# EasyEDA schematic Photodiode plate.json
TITLE: Sheet_1; REV: 1.0; Date: 2024-04-13; Sheet: 1/1; Company: Your Company
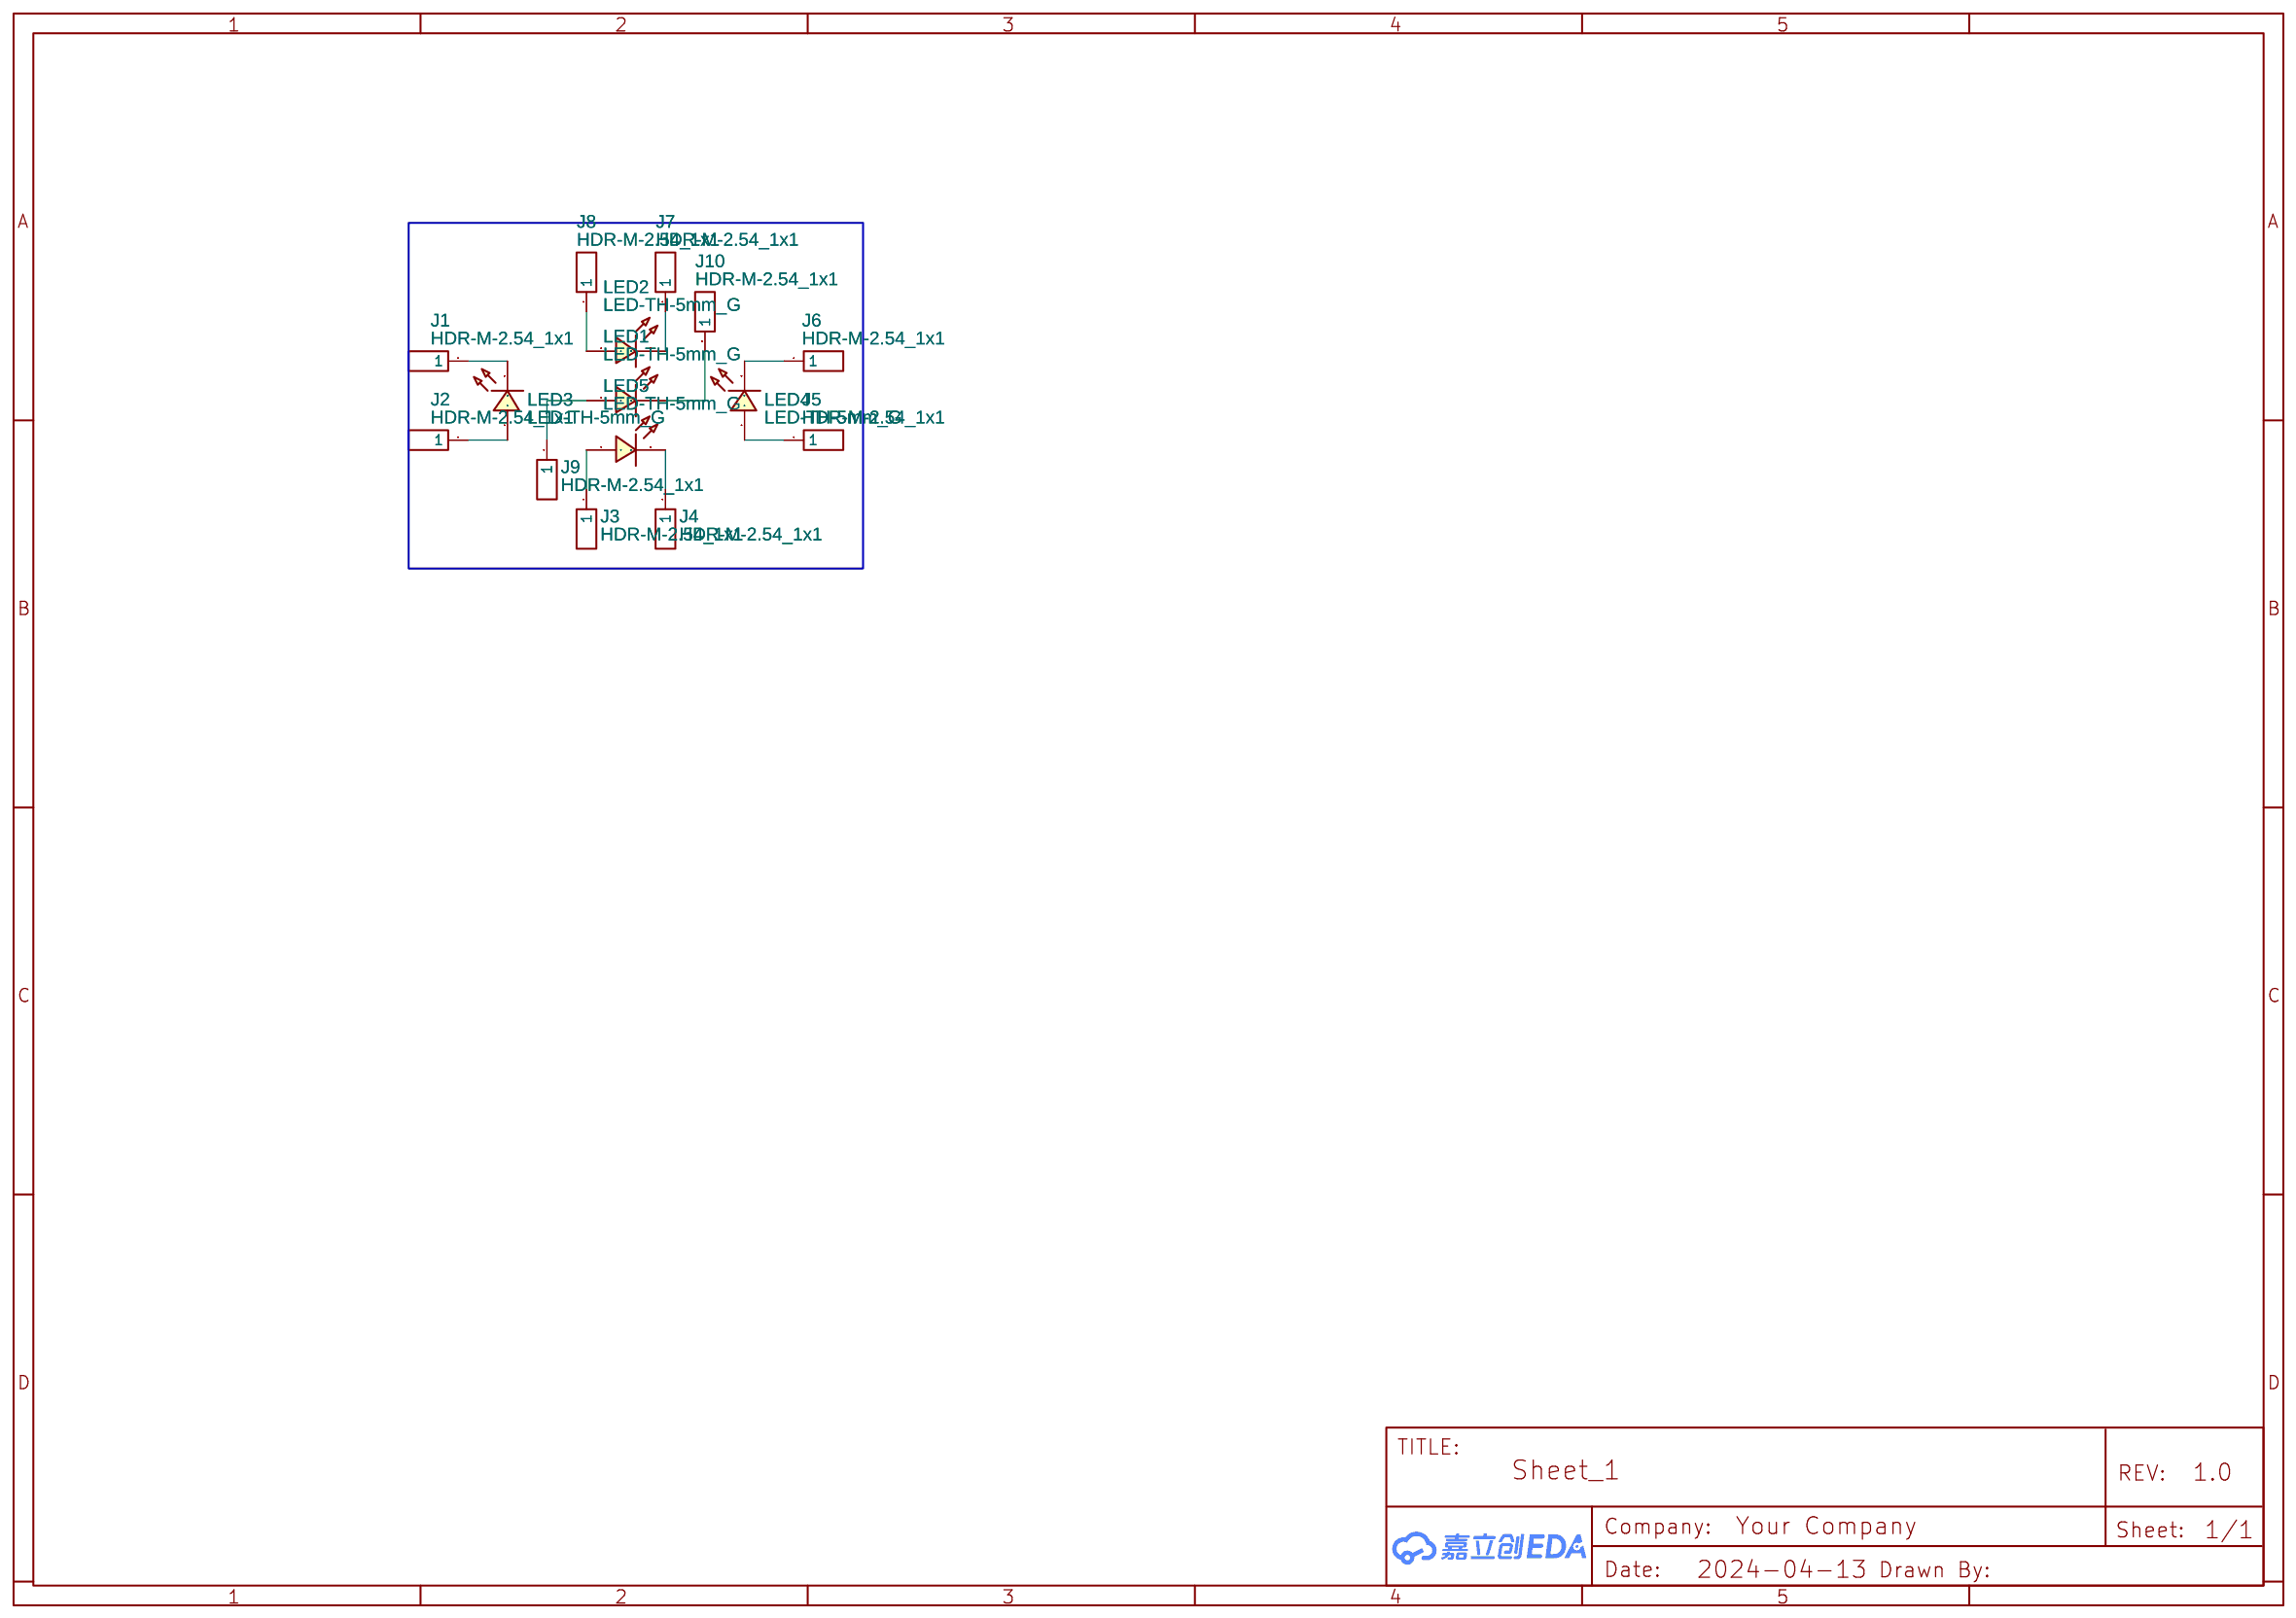
[diagram p0: schematic sheet]

## Parts
J1  HDR-M-2.54_1x1  [HDR-M-2.54_1X1]
J2  HDR-M-2.54_1x1  [HDR-M-2.54_1X1]
J3  HDR-M-2.54_1x1  [HDR-M-2.54_1X1]
J4  HDR-M-2.54_1x1  [HDR-M-2.54_1X1]
J5  HDR-M-2.54_1x1  [HDR-M-2.54_1X1]
J6  HDR-M-2.54_1x1  [HDR-M-2.54_1X1]
J7  HDR-M-2.54_1x1  [HDR-M-2.54_1X1]
J8  HDR-M-2.54_1x1  [HDR-M-2.54_1X1]
J9  HDR-M-2.54_1x1  [HDR-M-2.54_1X1]
J10  HDR-M-2.54_1x1  [HDR-M-2.54_1X1]
LED1  LED-TH-5mm_G  [LED-TH_BD5.0_GREEN]
LED2  LED-TH-5mm_G  [LED-TH_BD5.0_GREEN]
LED3  LED-TH-5mm_G  [LED-TH_BD5.0_GREEN]
LED4  LED-TH-5mm_G  [LED-TH_BD5.0_GREEN]
LED5  LED-TH-5mm_G  [LED-TH_BD5.0_GREEN]

## Library data of the parts
J1-J10 = HDR-M-2.54_1x1: Supplier Part: C81276; Supplier: LCSC; Contributor: LCEDA_Lib
LED1-LED5 = LED-TH-5mm_G: Manufacturer: EVERLIGHT(台湾亿光); Manufacturer Part: 333-2SYGD/S530-E2; Supplier Part: C88163; Supplier: LCSC; Contributor: LCEDA_Lib

## Nets
Net-(J1-1): J1.1 LED3.2
Net-(J2-1): J2.1 LED3.1
Net-(J3-1): J3.1 LED5.1
Net-(J4-1): J4.1 LED5.2
Net-(J5-1): J5.1 LED4.1
Net-(J6-1): J6.1 LED4.2
Net-(J7-1): J7.1 LED2.2
Net-(J8-1): J8.1 LED2.1
Net-(J9-1): J9.1 LED1.1
Net-(J10-1): J10.1 LED1.2
